# Altium schematic sheet 03_MCU.SchDoc: OpenCamera Slider - MCU
size A4; SheetNumber: 3; SheetTotal: 4; sk_ProjectName: WInFiDEL Sensor; sk_Title: Microcontroller
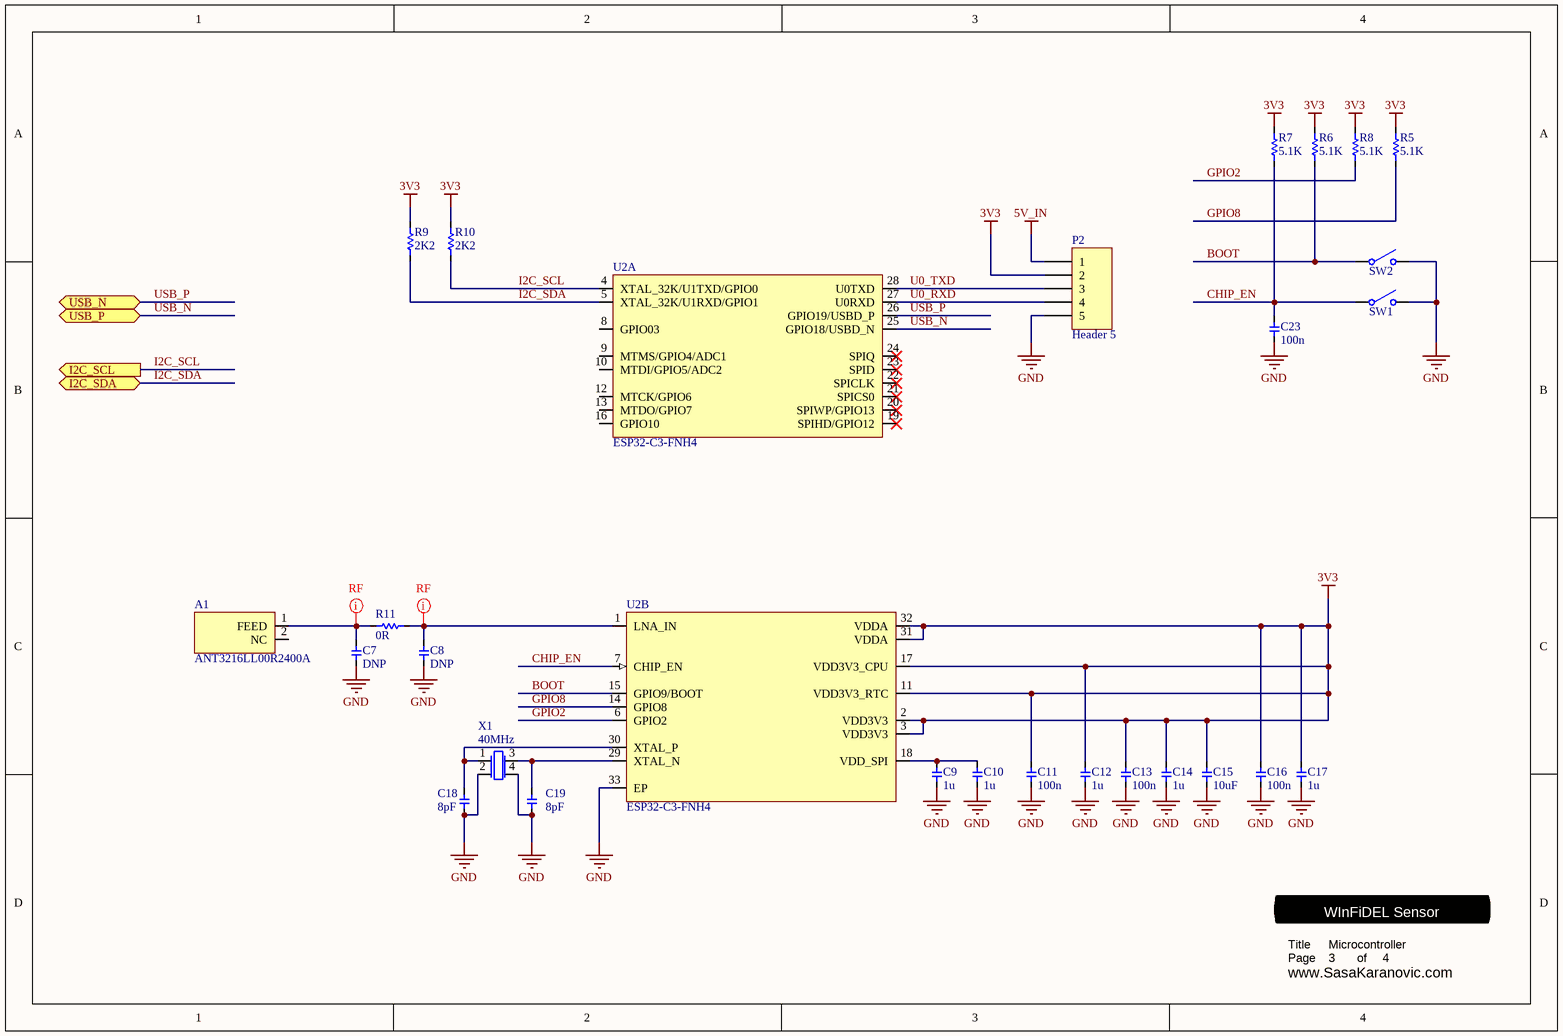
[diagram p0: 03_MCU.SchDoc]

## Parts
A1  ANT3216LL00R2400A  [ANT3216LL00R2400A]
C7  value DNP  [0603 - CAP]  (hidden comment: Cap)  (no BOM)
C8  value DNP  [0603 - CAP]  (hidden comment: Cap)  (no BOM)
C9  value 1u  [0603 - CAP]  (hidden comment: Cap)
C10  value 1u  [0603 - CAP]  (hidden comment: Cap)
C11  value 100n  [0603 - CAP]  (hidden comment: Cap)
C12  value 1u  [0603 - CAP]  (hidden comment: Cap)
C13  value 100n  [0603 - CAP]  (hidden comment: Cap)
C14  value 1u  [0603 - CAP]  (hidden comment: Cap)
C15  value 10uF  [0603 - CAP]  (hidden comment: Cap)
C16  value 100n  [0603 - CAP]  (hidden comment: Cap)
C17  value 1u  [0603 - CAP]  (hidden comment: Cap)
C18  value 8pF  [0603 - CAP]  (hidden comment: Cap)
C19  value 8pF  [0603 - CAP]  (hidden comment: Cap)
C23  value 100n  [0603 - CAP]  (hidden comment: Cap)
P2  Header 5  [Header 5x1]  (no BOM)
R5  value 5.1K  [0603]  (hidden comment: Res)
R6  value 5.1K  [0603]  (hidden comment: Res)
R7  value 5.1K  [0603]  (hidden comment: Res)
R8  value 5.1K  [0603]  (hidden comment: Res)
R9  value 2K2  [0603]  (hidden comment: Res)
R10  value 2K2  [0603]  (hidden comment: Res)
R11  value 0R  [0603]  (hidden comment: Res)
SW1  Switch  [Switch-XDTD-0304-215]  (value not drawn)
SW2  Switch  [Switch-XDTD-0304-215]  (value not drawn)
U2  ESP32-C3-FNH4  [QFN50P500X500X100_HS-33N]  (parts A,B of 2)
X1  40MHz  [XTAL-4LEAD-2016]

## Ports
I2C_SCL (out), I2C_SDA (bidir), USB_N (bidir), USB_P (bidir)

## Nets
3V3: C11.2 C12.2 C13.2 C14.2 C15.2 C16.2 C17.2 P2.2 R5.1 R6.1 R7.1 R8.1 R9.1 R10.1 U2.2(VDD3V3) U2.3(VDD3V3) U2.11(VDD3V3_RTC) U2.17(VDD3V3_CPU) U2.31(VDDA) U2.32(VDDA)
5V_IN: P2.1
GND: C7.1 C8.1 C9.1 C10.1 C11.1 C12.1 C13.1 C14.1 C15.1 C16.1 C17.1 C18.2 C19.1 C23.1 P2.5 SW1.2(COMMON2) SW2.2(COMMON2) U2.33(EP) X1.2(GND) X1.4(GND)
BOOT: R6.2 SW2.1(COMMON1) U2.15(GPIO9/BOOT)
CHIP_EN: C23.2 R7.2 SW1.1(COMMON1) U2.7(CHIP_EN)
GPIO2: R8.2 U2.6(GPIO2)
GPIO8: R5.2 U2.14(GPIO8)
I2C_SCL: R10.2 U2.4(XTAL_32K/U1TXD/GPIO0) ; port I2C_SCL
I2C_SDA: R9.2 U2.5(XTAL_32K/U1RXD/GPIO1) ; port I2C_SDA
U0_RXD: P2.4 U2.27(U0RXD)
U0_TXD: P2.3 U2.28(U0TXD)
USB_N: U2.25(GPIO18/USBD_N) ; port USB_P
USB_P: U2.26(GPIO19/USBD_P) ; port USB_N
NetA1_1: A1.1(FEED) C7.2 R11.1
NetC8_2: C8.2 R11.2 U2.1(LNA_IN)
NetC9_2: C9.2 C10.2 U2.18(VDD_SPI)
NetC18_1: C18.1 U2.30(XTAL_P) X1.1(OSC1)
NetC19_2: C19.2 U2.29(XTAL_N) X1.3(OSC3)

Not connected (* = marked no-connect by the designer): A1 2(NC); U2 8(GPIO03) 9(MTMS/GPIO4/ADC1) 10(MTDI/GPIO5/ADC2) 12(MTCK/GPIO6) 13(MTDO/GPIO7) 16(GPIO10) 19(SPIHD/GPIO12)* 20(SPIWP/GPIO13)* 21(SPICS0)* 22(SPICLK)* 23(SPID)* 24(SPIQ)*

## Layout directives
net class RF: NetA1_1, NetC8_2

## Notes on the sheet
- Page
- Title
- www.SasaKaranovic.com <http://www.SasaKaranovic.com>
- of

## Library data of the parts
A1 = ANT3216LL00R2400A: RF ANT 2.45GHZ CHIP SOLDER SMD; Manufacturer: YAGEO; Manufacturer Part Number: ANT3216LL00R2400A; Distributor: LCSC; Distributor Part Number: ANT3216LL00R2400A
C7 C8 = Cap: Capacitor
C9 C10 C12 C14 C17 = Cap: Capacitor; Manufacturer: YAGEO; Manufacturer Part Number: CC0603KRX7R9BB105; Temp Rating: X7R; Voltage: 50V; Distributor Part Number: C559769; Distributor: LCSC
C11 C13 C16 C23 = Cap: Capacitor; Manufacturer: Samsung Electro-Mechanics; Manufacturer Part Number: CL10B104KB8NNNC; Temp Rating: X7R; Voltage: 50V; Distributor Part Number: C1591; Distributor: LCSC
C15 = Cap: Capacitor; Manufacturer: Samsung Electro-Mechanics; Manufacturer Part Number: CL21A106KAYNNNE; Voltage: 25V; Distributor Part Number: C15850; Distributor: LCSC
C18 C19 = Cap: Capacitor; Manufacturer: YAGEO; Manufacturer Part Number: CC0603CRNPO9BN8R0; Temp Rating: NP0; Voltage: 50V; Distributor Part Number: C327316; Distributor: LCSC
P2 = Header 5: Header, 5-Pin
R5-R8 = Res: Resistor; Manufacturer: YAGEO; Manufacturer Part Number: RC0603FR-075K1L; Power Rating: 100mW; Tolerance: 1%; Distributor: LCSC; Distributor Part Number: C105580
R9 R10 = Res: Resistor; Manufacturer: YAGEO; Manufacturer Part Number: AC0603FR-072K2L; Power Rating: 100mW; Tolerance: 1%; Distributor: LCSC; Distributor Part Number: C125931
R11 = Res: Resistor; Manufacturer: YAGEO; Manufacturer Part Number: RC0603JR-070RL; Power Rating: 100mW; Tolerance: 5%; Distributor: LCSC; Distributor Part Number: C95177
SW1 SW2 = Switch -XDTD-0304-215: 50mA Surface Mount SPST 100MΩ 100,000 Times 12V 160gf@±50gf SMD Tactile Switches ROHS; Manufacturer: Lian Xin Technology; Manufacturer Part Number: XDTD-0304-215; Distributor: LCSC; Distributor Part Number: C7498203
U2 = ESP32-C3-FNH4: Ultra-Low-Power SoC with RISC-V Single-Core CPU 2.4 GHz Wi-Fi (802.11 b/g/n) and Bluetooth® 5 (LE); Manufacturer: Espressif Systems; Manufacturer Part Number: ESP32-C3FH4; Distributor: LCSC; Distributor Part Number: C2858491
X1 = XTAL-40MHz-R940000171: 40MHz 9pF ±10ppm SMD2016-4P Crystals ROHS; Manufacturer: TROQ; Manufacturer Part Number: R940000171; Distributor: LCSC; Distributor Part Number: C2929402